# Altium schematic sheet MCU_STM32C8T6.SchDoc
size A4
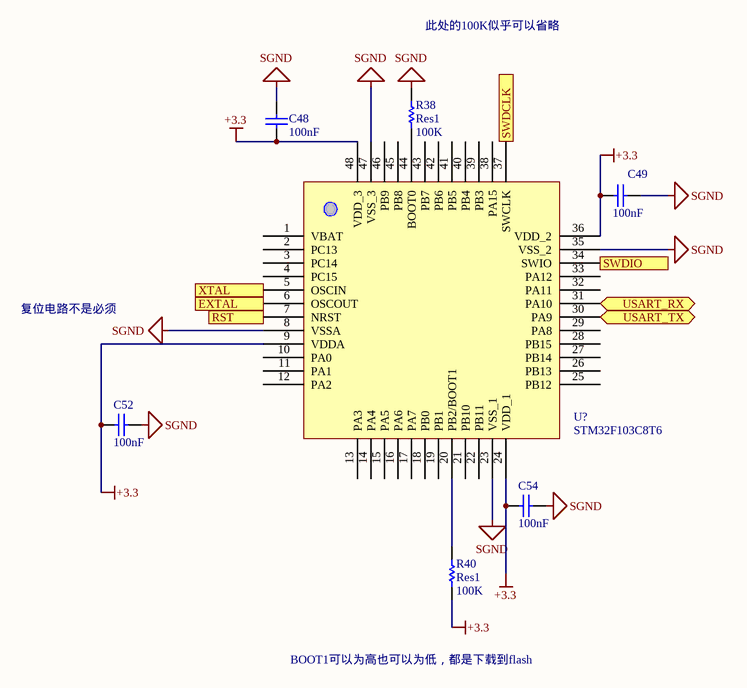
[diagram p0: MCU_STM32C8T6.SchDoc]

## Parts
C48  value 100nF  [0603]  (hidden comment: Cap)
C49  value 100nF  [0603]  (hidden comment: Cap)
C52  value 100nF  [0603]  (hidden comment: Cap)
C54  value 100nF  [0603]  (hidden comment: Cap)
R38  Res1  value 100K  [0805]
R40  Res1  value 100K  [0805]
U?  STM32F103C8T6  [LQFP-48_M]

## Ports
EXTAL (in), RST (in), SWDCLK (in), SWDIO (in), USART_RX (bidir), USART_TX (bidir), XTAL (in)

## Nets
+3.3: C48.1 C49.1 C52.1 C54.1 R40.1 U?.9(VDDA) U?.24(VDD_1) U?.36(VDD_2) U?.48(VDD_3)
SGND: C48.2 C49.2 C52.2 C54.2 R38.2 U?.8(VSSA) U?.23(VSS_1) U?.35(VSS_2) U?.47(VSS_3)
EXTAL: U?.6(OSCOUT) ; port EXTAL
RST: U?.7(NRST) ; port RST
SWDCLK: U?.37(SWCLK) ; port SWDCLK
SWDIO: U?.34(SWIO) ; port SWDIO
USART_RX: U?.31(PA10) ; port USART_RX
USART_TX: U?.30(PA9) ; port USART_TX
XTAL: U?.5(OSCIN) ; port XTAL
NetR38_1: R38.1 U?.44(BOOT0)
NetR40_2: R40.2 U?.20(PB2/BOOT1)

Not connected (* = marked no-connect by the designer): U? 1(VBAT) 2(PC13) 3(PC14) 4(PC15) 10(PA0) 11(PA1) 12(PA2) 13(PA3) 14(PA4) 15(PA5) 16(PA6) 17(PA7) 18(PB0) 19(PB1) 21(PB10) 22(PB11) 25(PB12) 26(PB13) 27(PB14) 28(PB15) 29(PA8) 32(PA11) 33(PA12) 38(PA15) 39(PB3) 40(PB4) 41(PB5) 42(PB6) 43(PB7) 45(PB8) 46(PB9)

## Notes on the sheet
- 此处的100K似乎可以省略
- 复位电路不是必须
- BOOT1可以为高也可以为低，都是下载到flash

## Library data of the parts
C48 C49 C52 C54 = Cap: 无极性电容; Published: 8-Jun-2000; LatestRevisionDate: 17-Jul-2002; LatestRevisionNote: Re-released for DXP Platform.; PackageReference: RAD-0.3; Publisher: Altium Limited
R38 R40 = Res1: Resistor; Published: 8-Jun-2000; LatestRevisionDate: 17-Jul-2002; LatestRevisionNote: Re-released for DXP Platform.; PackageReference: AXIAL-0.3; Publisher: Altium Limited; PackageDescription: Axial Device, Thru-Hole; 2 Leads; 0.3 in Pin Spacing
U? = STM32F103C8T6: STM32单片机48引脚